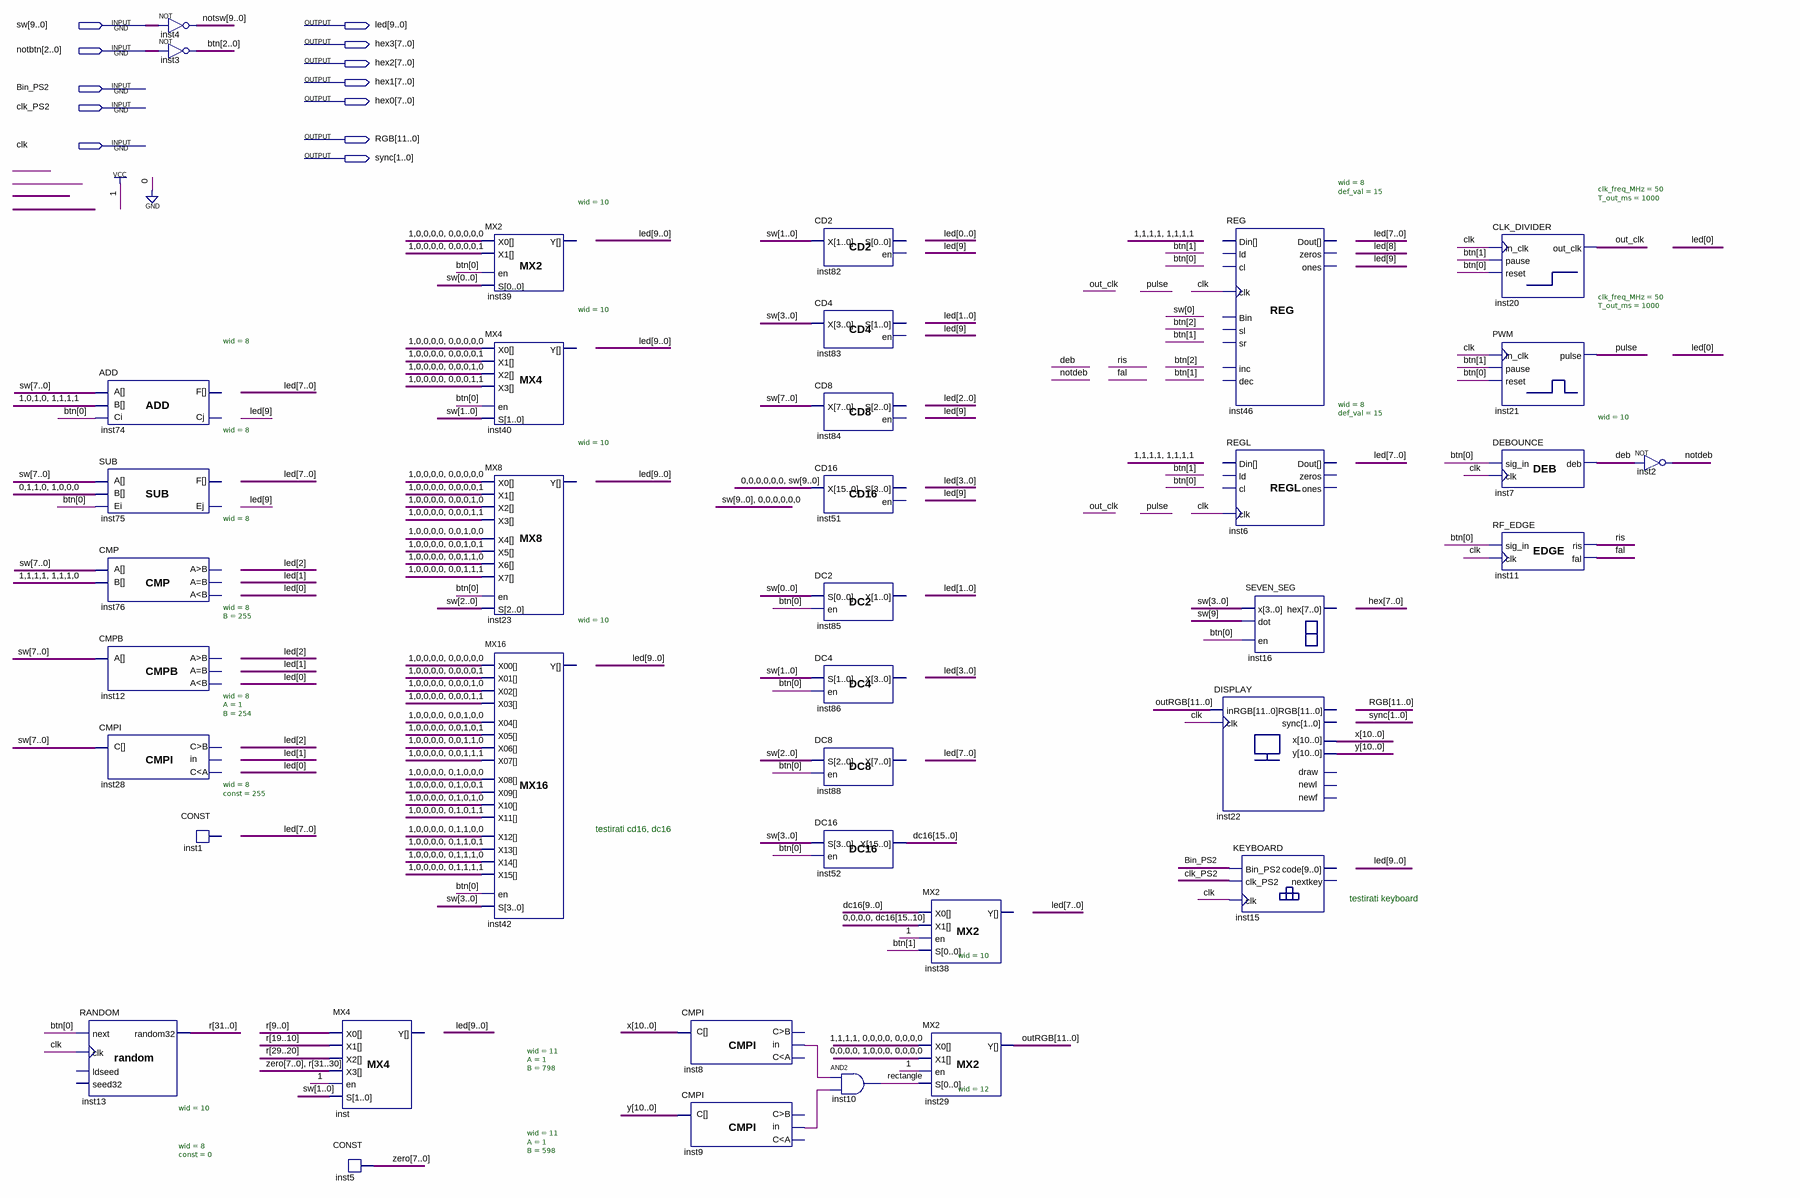
[diagram p0: schematic sheet]
// Quartus schematic test_components.bdf as structural Verilog: 38 symbols, 12 pins
module test_components (
  input  [9:0] sw,
  input  [2:0] notbtn,
  input  Bin_PS2,
  input  clk_PS2,
  input  clk,
  output [9:0] led,
  output [7:0] hex3,
  output [7:0] hex2,
  output [7:0] hex1,
  output [7:0] hex0,
  output [11:0] RGB,
  output [1:0] sync
);

  wire deb, fal, inst8_isin, inst9_isin, notdeb, out_clk, pulse, rectangle, ris;
  wire [2:0] btn;
  wire [7:0] zero;
  wire [9:0] notsw;
  wire [10:0] x, y;
  wire [11:0] outRGB;
  wire [15:0] dc16;
  wire [31:0] r;

  ADD #(.wid(8)) inst74 (.A(sw[7:0]), .B(8'b10101111), .Ci(btn[0]));  // open: F, Cj
  SUB #(.wid(8)) inst75 (.A(sw[7:0]), .B(8'b01101000), .Ei(btn[0]));  // open: F, Ej
  CMP #(.wid(8)) inst76 (.A(sw[7:0]), .B(8'b11111110));  // open: gr, eq, ls
  CMPB #(.wid(8), .B(255)) inst12 (.A(sw[7:0]));  // open: gr, eq, ls
  CMPI #(.wid(8), .A(1), .B(254)) inst28 (.C(sw[7:0]));  // open: gr, isin, ls
  RANDOM inst13 (.next(btn[0]), .clk(clk), .random(r));  // open: ldseed, seed
  assign notsw = ~sw;  // NOT inst4, 10 bits wide
  assign btn = ~notbtn;  // NOT inst3, 3 bits wide
  CONST #(.wid(8), .\const (255)) inst1 ();  // open: data
  MX4 #(.wid(10)) inst (
    .X0(r[9:0]), .X1(r[19:10]), .X2(r[29:20]), .X3({zero, r[31:30]}), .en(1'b1), .S(sw[1:0]));  // open: Y
  CONST #(.wid(8), .\const (0)) inst5 (.data(zero));
  MX2 #(.wid(10)) inst39 (.X0(10'b1000000000), .X1(10'b1000000001), .en(btn[0]), .S(sw[0]));  // open: Y
  MX4 #(.wid(10)) inst40 (
    .X0(10'b1000000000), .X1(10'b1000000001), .X2(10'b1000000010), .X3(10'b1000000011), .en(btn[0]),
    .S(sw[1:0]));  // open: Y
  MX8 #(.wid(10)) inst23 (
    .X0(10'b1000000000), .X1(10'b1000000001), .X2(10'b1000000010), .X3(10'b1000000011), .X4(10'b1000000100),
    .X5(10'b1000000101), .X6(10'b1000000110), .X7(10'b1000000111), .en(btn[0]), .S(sw[2:0]));  // open: Y
  MX16 #(.wid(10)) inst42 (
    .X00(10'b1000000000), .X01(10'b1000000001), .X02(10'b1000000010), .X03(10'b1000000011),
    .X04(10'b1000000100), .X05(10'b1000000101), .X06(10'b1000000110), .X07(10'b1000000111),
    .X08(10'b1000001000), .X09(10'b1000001001), .X10(10'b1000001010), .X11(10'b1000001011),
    .X12(10'b1000001100), .X13(10'b1000001101), .X14(10'b1000001110), .X15(10'b1000001111), .en(btn[0]),
    .S(sw[3:0]));  // open: Y
  CMPI #(.wid(11), .A(1), .B(798)) inst8 (.C(x), .isin(inst8_isin));  // open: gr, ls
  CMPI #(.wid(11), .A(1), .B(598)) inst9 (.C(y), .isin(inst9_isin));  // open: gr, ls
  CD2 inst82 (.X(sw[1:0]));  // open: S, en
  CD4 inst83 (.X(sw[3:0]));  // open: S, en
  CD8 inst84 (.X(sw[7:0]));  // open: S, en
  CD16 inst51 (.X({{6{1'b0}}, sw}));  // open: S, en
  DC2 inst85 (.S(sw[0]), .en(btn[0]));  // open: X
  DC4 inst86 (.S(sw[1:0]), .en(btn[0]));  // open: X
  DC8 inst88 (.S(sw[2:0]), .en(btn[0]));  // open: X
  DC16 inst52 (.S(sw[3:0]), .en(btn[0]), .X(dc16));
  and inst10 (rectangle, inst8_isin, inst9_isin);
  MX2 #(.wid(10)) inst38 (.X0(dc16[9:0]), .X1({4'b0000, dc16[15:10]}), .en(1'b1), .S(btn[1]));  // open: Y
  MX2 #(.wid(12)) inst29 (.X0(12'b111100000000), .X1(12'b000010000000), .en(1'b1), .S(rectangle), .Y(outRGB));
  DISPLAY inst22 (.inRGB(outRGB), .clk(clk), .x(x), .y(y));  // open: RGB, sync, draw, newl, newf
  REG #(.wid(8), .def_val(15)) inst46 (.clk(clk));  // open: ld, cl, Bin, sl, sr, inc, dec, Din, Dout, zeros, ones
  REGL #(.wid(8), .def_val(15)) inst6 (.clk(clk));  // open: Din, ld, cl, Dout, zeros, ones
  SEVEN_SEG inst16 (.x(sw[3:0]), .dot(sw[9]), .en(btn[0]));  // open: hex
  KEYBOARD inst15 (.Bin_PS2(Bin_PS2), .clk_PS2(clk_PS2), .clk(clk));  // open: code, nextkey
  CLK_DIVIDER #(.clk_freq_MHz(50), .T_out_ms(1000)) inst20 (
    .in_clk(clk), .pause(btn[1]), .reset(btn[0]), .out_clk(out_clk));
  PWM #(.clk_freq_MHz(50), .T_out_ms(1000)) inst21 (.in_clk(clk), .pause(btn[1]), .reset(btn[0]), .pulse(pulse));
  DEBOUNCE #(.wid(10)) inst7 (.sig_in(btn[0]), .clk(clk), .deb(deb));
  RF_EDGE inst11 (.sig_in(btn[0]), .clk(clk), .ris(ris), .fal(fal));
  not inst2 (notdeb, deb);

  // Notes on the sheet:
  //   testirati cd16, dc16
  //   testirati keyboard
endmodule
